# Altium project Marsault1.PrjPcb (part 4 of 7)

## Sheet MICROCONTROLLER.SchDoc
size A4; SheetNumber: 4; SheetTotal: 9
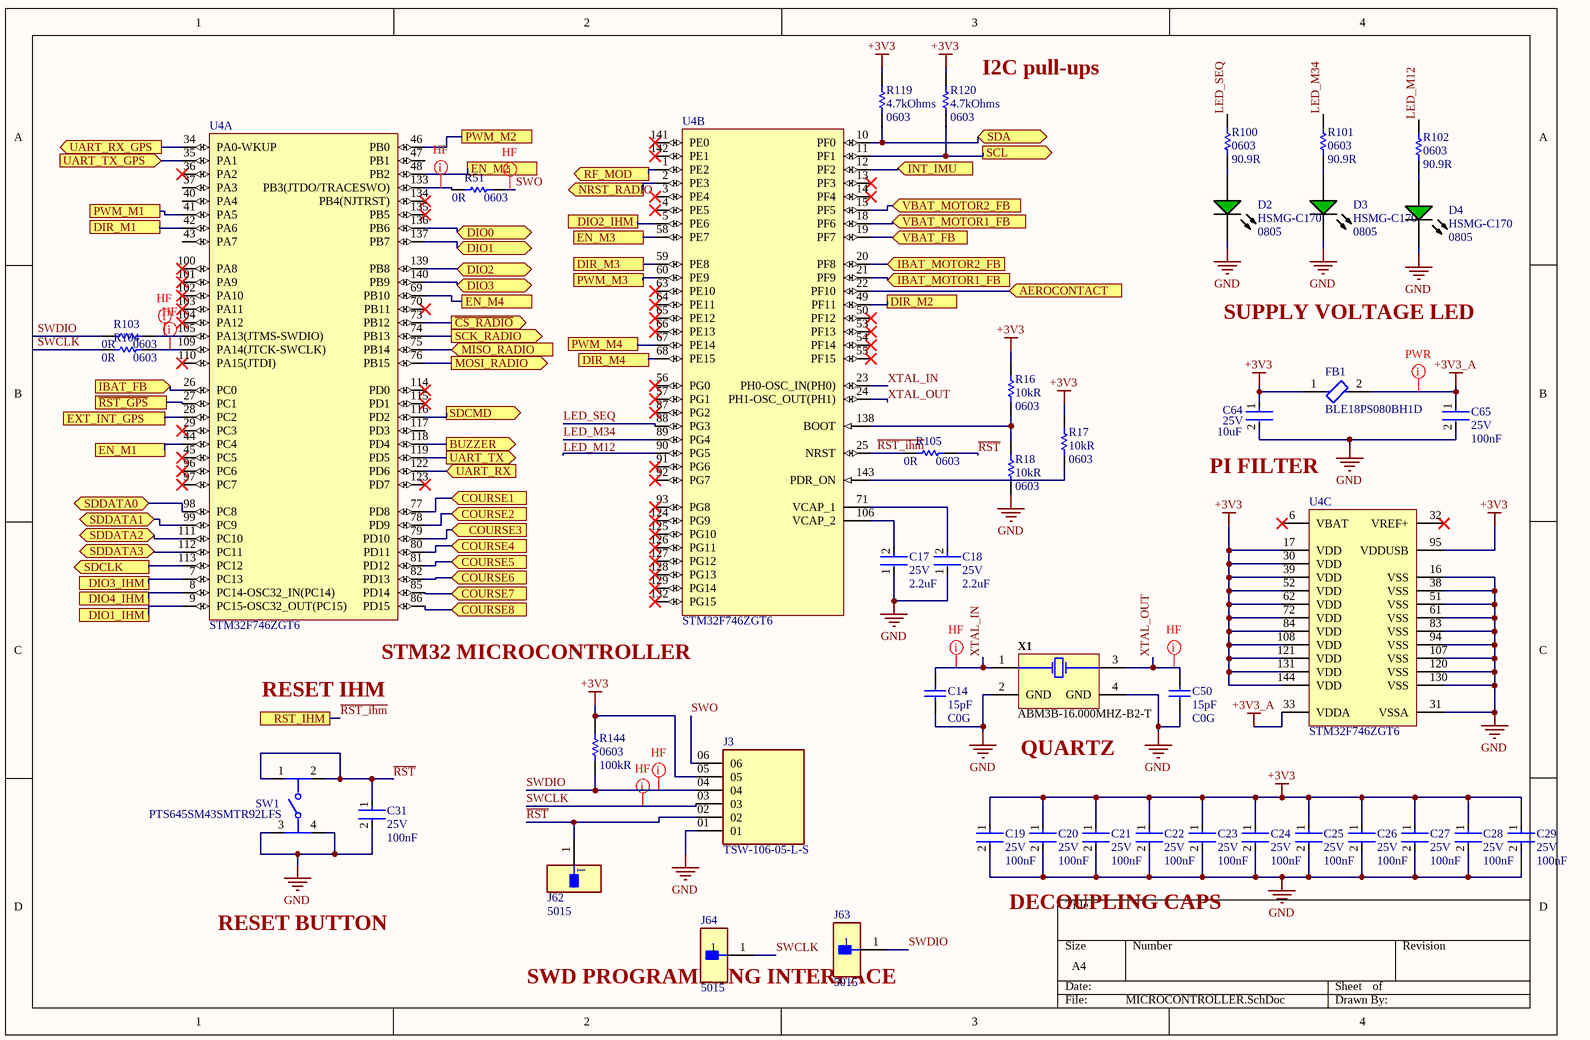
[diagram p4: MICROCONTROLLER.SchDoc]

### Parts
C14  Capacitance: 15pF  Dielectric: C0G  [CAPC1608X92X38ML15T08]  (hidden comment: VJ0603D150JXPAJ)
C17  Voltage Rating (DC): 25V  Capacitance: 2.2uF  [FP-C1608-080-0_1-MFG]  (hidden comment: C1608X5R1E225K080AB)
C18  Voltage Rating (DC): 25V  Capacitance: 2.2uF  [FP-C1608-080-0_1-MFG]  (hidden comment: C1608X5R1E225K080AB)
C19  Voltage Rating (DC): 25V  Capacitance: 100nF  [FP-CGA3E-0_3-0_1-MFG]  (hidden comment: CGA3E2X7R1E104K080AA)
C20  Voltage Rating (DC): 25V  Capacitance: 100nF  [FP-CGA3E-0_3-0_1-MFG]  (hidden comment: CGA3E2X7R1E104K080AA)
C21  Voltage Rating (DC): 25V  Capacitance: 100nF  [FP-CGA3E-0_3-0_1-MFG]  (hidden comment: CGA3E2X7R1E104K080AA)
C22  Voltage Rating (DC): 25V  Capacitance: 100nF  [FP-CGA3E-0_3-0_1-MFG]  (hidden comment: CGA3E2X7R1E104K080AA)
C23  Voltage Rating (DC): 25V  Capacitance: 100nF  [FP-CGA3E-0_3-0_1-MFG]  (hidden comment: CGA3E2X7R1E104K080AA)
C24  Voltage Rating (DC): 25V  Capacitance: 100nF  [FP-CGA3E-0_3-0_1-MFG]  (hidden comment: CGA3E2X7R1E104K080AA)
C25  Voltage Rating (DC): 25V  Capacitance: 100nF  [FP-CGA3E-0_3-0_1-MFG]  (hidden comment: CGA3E2X7R1E104K080AA)
C26  Voltage Rating (DC): 25V  Capacitance: 100nF  [FP-CGA3E-0_3-0_1-MFG]  (hidden comment: CGA3E2X7R1E104K080AA)
C27  Voltage Rating (DC): 25V  Capacitance: 100nF  [FP-CGA3E-0_3-0_1-MFG]  (hidden comment: CGA3E2X7R1E104K080AA)
C28  Voltage Rating (DC): 25V  Capacitance: 100nF  [FP-CGA3E-0_3-0_1-MFG]  (hidden comment: CGA3E2X7R1E104K080AA)
C29  Voltage Rating (DC): 25V  Capacitance: 100nF  [FP-CGA3E-0_3-0_1-MFG]  (hidden comment: CGA3E2X7R1E104K080AA)
C31  Voltage Rating (DC): 25V  Capacitance: 100nF  [FP-CGA3E-0_3-0_1-MFG]  (hidden comment: CGA3E2X7R1E104K080AA)
C50  Capacitance: 15pF  Dielectric: C0G  [CAPC1608X92X38ML15T08]  (hidden comment: VJ0603D150JXPAJ)
C64  Voltage Rating (DC): 25V  Capacitance: 10uF  [FP-C2012-125-0_2-IPC_B]  (hidden comment: C2012X5R1E106K125AB)
C65  Voltage Rating (DC): 25V  Capacitance: 100nF  [FP-CGA3E-0_3-0_1-MFG]  (hidden comment: CGA3E2X7R1E104K080AA)
D2  HSMG-C170  Case/Package: 0805  [AVAG-HSMX-C170_V]
D3  HSMG-C170  Case/Package: 0805  [AVAG-HSMX-C170_V]
D4  HSMG-C170  Case/Package: 0805  [AVAG-HSMX-C170_V]
FB1  BLE18PS080BH1D  [FP-BLE18-0_15-t0_6-MFG]
J3  TSW-106-05-L-S  [SAMTEC_TSW-106-05-L-S]
J62  5015  [FP-5015-MFG]
J63  5015  [FP-5015-MFG]
J64  5015  [FP-5015-MFG]
R16  Resistance: 10kR  Case Code (Imperial): 0603  [RESC1609X55X30LL15T15]  (hidden comment: ERJ3EKF1002V)
R17  Resistance: 10kR  Case Code (Imperial): 0603  [RESC1609X55X30LL15T15]  (hidden comment: ERJ3EKF1002V)
R18  Resistance: 10kR  Case Code (Imperial): 0603  [RESC1609X55X30LL15T15]  (hidden comment: ERJ3EKF1002V)
R51  Case Code (Imperial): 0603  Resistance: 0R  [RESC1608X55X25ML10T15]  (hidden comment: RC0603JR-070RL)
R100  Case Code (Imperial): 0603  Resistance: 90.9R  [RESC1609X50X30NL10T20]  (hidden comment: CRCW060390R9FKEA)
R101  Case Code (Imperial): 0603  Resistance: 90.9R  [RESC1609X50X30NL10T20]  (hidden comment: CRCW060390R9FKEA)
R102  Case Code (Imperial): 0603  Resistance: 90.9R  [RESC1609X50X30NL10T20]  (hidden comment: CRCW060390R9FKEA)
R103  Case Code (Imperial): 0603  Resistance: 0R  [RESC1608X55X25ML10T15]  (hidden comment: RC0603JR-070RL)
R104  Case Code (Imperial): 0603  Resistance: 0R  [RESC1608X55X25ML10T15]  (hidden comment: RC0603JR-070RL)
R105  Case Code (Imperial): 0603  Resistance: 0R  [RESC1608X55X25ML10T15]  (hidden comment: RC0603JR-070RL)
R119  Resistance: 4.7kOhms  Case Code - in: 0603  [RESC1608X55X25LL10T15]  (hidden comment: RC0603FR-074K7L)
R120  Resistance: 4.7kOhms  Case Code - in: 0603  [RESC1608X55X25LL10T15]  (hidden comment: RC0603FR-074K7L)
R144  Case Code (Imperial): 0603  Resistance: 100kR  [RESC1608X55X30ML20T20]  (hidden comment: ERA3AEB104V)
SW1  PTS645SM43SMTR92LFS  [FP-PTS645SM43SMTR92LFS-MFG]
U4  STM32F746ZGT6  [STM-LQFP144_V]  (parts A,B,C of 3)
X1  ABM3B-16.000MHZ-B2-T  [ABRA-ABM3B-4_V]

### Ports
AEROCONTACT (in), BUZZER (out), COURSE1 (in), COURSE2 (in), COURSE3 (in), COURSE4 (in), COURSE5 (in), COURSE6 (in), COURSE7 (in), COURSE8 (in), DIO0 (bidir), DIO1 (bidir), DIO1_IHM, DIO2 (bidir), DIO2_IHM, DIO3 (bidir), DIO3_IHM, DIO4_IHM, DIR_M1, DIR_M2, DIR_M3, DIR_M4, EN_M1, EN_M2, EN_M3, EN_M4, EXT_INT_GPS, IBAT_FB (in), IBAT_MOTOR1_FB (in), IBAT_MOTOR2_FB (in), INT_IMU (in), MISO_RADIO (in), MOSI_RADIO (out), NRST_RADIO (out), PWM_M1, PWM_M2, PWM_M3, PWM_M4, RF_MOD (out), RST_IHM, SCK_RADIO (out), SCL (out), SDA (bidir), SDCLK (out), SDCMD (out), SDDATA0 (bidir), SDDATA1 (bidir), SDDATA2 (bidir), SDDATA3 (bidir), UART_RX (in), UART_RX_GPS (out), UART_TX (out), UART_TX_GPS (in), VBAT_FB (in), VBAT_MOTOR1_FB (in), VBAT_MOTOR2_FB (in), ~{CS_RADIO} (out), ~{RST_GPS}

### Nets
+3V3: C19.1 C20.1 C21.1 C22.1 C23.1 C24.1 C25.1 C26.1 C27.1 C28.1 C29.1 C64.1 FB1.1 J3.05 R16.2 R17.2 R119.2 R120.2 R144.2 U4.17(VDD) U4.30(VDD) U4.39(VDD) U4.52(VDD) U4.62(VDD) U4.72(VDD) U4.84(VDD) U4.95(VDDUSB) U4.108(VDD) U4.121(VDD) U4.131(VDD) U4.144(VDD)
+3V3_A: C65.1 FB1.2 U4.33(VDDA)
GND: C14.1 C17.1 C18.1 C19.2 C20.2 C21.2 C22.2 C23.2 C24.2 C25.2 C26.2 C27.2 C28.2 C29.2 C31.2 C50.1 C64.2 C65.2 D2.2(K) D3.2(K) D4.2(K) J3.01 R18.1 SW1.3 SW1.4 U4.16(VSS) U4.31(VSSA) U4.38(VSS) U4.51(VSS) U4.61(VSS) U4.83(VSS) U4.94(VSS) U4.107(VSS) U4.120(VSS) U4.130(VSS) X1.2(GND) X1.4(GND)
~{RST}: C31.1 J3.02 J62.1 R105.2 SW1.1 SW1.2
~{RST_GPS}: U4.27(PC1) ; port ~{RST_GPS}
~{RST_ihm}: R105.1 U4.25(NRST) ; port RST_IHM
DIO1_IHM: U4.9(PC15-OSC32_OUT(PC15)) ; port DIO1_IHM
DIO2_IHM: U4.5(PE6) ; port DIO2_IHM
DIO3_IHM: U4.7(PC13) ; port DIO3_IHM
DIO4_IHM: U4.8(PC14-OSC32_IN(PC14)) ; port DIO4_IHM
LED_M12: R102.2 U4.90(PG5)
LED_M34: R101.2 U4.89(PG4)
LED_SEQ: R100.2 U4.88(PG3)
MISO_RADIO: U4.75(PB14) ; port MISO_RADIO
SDCLK: U4.113(PC12) ; port SDCLK
SDCMD: U4.116(PD2) ; port SDCMD
SDDATA0: U4.98(PC8) ; port SDDATA0
SDDATA1: U4.99(PC9) ; port SDDATA1
SDDATA2: U4.111(PC10) ; port SDDATA2
SDDATA3: U4.112(PC11) ; port SDDATA3
SWCLK: J3.03 J64.1 R104.1
SWDIO: J3.04 J63.1 R103.1 R144.1
SWO: J3.06 R51.2
XTAL_IN: C14.2 U4.23(PH0-OSC_IN(PH0)) X1.1(X1)
XTAL_OUT: C50.2 U4.24(PH1-OSC_OUT(PH1)) X1.3(X2)
NetC17_2: C17.2 U4.106(VCAP_2)
NetC18_2: C18.2 U4.71(VCAP_1)
NetD2_1: D2.1(A) R100.1
NetD3_1: D3.1(A) R101.1
NetD4_1: D4.1(A) R102.1
NetJ71_1: U4.34(PA0-WKUP) ; port UART_RX_GPS
NetJ73_1: U4.35(PA1) ; port UART_TX_GPS
NetR16_1: R16.1 R18.2 U4.138(BOOT)
NetR17_1: R17.1 U4.143(PDR_ON)
NetR22_1: U4.28(PC2) ; port EXT_INT_GPS
NetR26_1: R120.1 U4.11(PF1) ; port SCL
NetR28_1: R119.1 U4.10(PF0) ; port SDA
NetR34_1: U4.73(PB12) ; port ~{CS_RADIO}
NetR35_1: U4.2(PE3) ; port NRST_RADIO
NetR36_1: U4.1(PE2) ; port RF_MOD
NetR39_1: U4.140(PB9) ; port DIO3
NetR40_1: U4.139(PB8) ; port DIO2
NetR43_1: U4.137(PB7) ; port DIO1
NetR44_1: U4.136(PB6) ; port DIO0
NetR45_1: U4.12(PF2) ; port INT_IMU
NetR46_1: U4.22(PF10) ; port AEROCONTACT
NetR51_1: R51.1 U4.133(PB3(JTDO/TRACESWO))
NetR54_1: U4.76(PB15) ; port MOSI_RADIO
NetR55_1: U4.74(PB13) ; port SCK_RADIO
NetR56_2: U4.41(PA5) ; port PWM_M1
NetR57_2: U4.42(PA6) ; port DIR_M1
NetR58_2: U4.44(PC4) ; port EN_M1
NetR59_1: U4.118(PD4) ; port BUZZER
NetR61_2: U4.46(PB0) ; port PWM_M2
NetR62_2: U4.49(PF11) ; port DIR_M2
NetR63_2: U4.48(PB2) ; port EN_M2
NetR69_2: U4.60(PE9) ; port PWM_M3
NetR70_2: U4.59(PE8) ; port DIR_M3
NetR71_1: U4.26(PC0) ; port IBAT_FB
NetR72_2: U4.58(PE7) ; port EN_M3
NetR73_1: U4.19(PF7) ; port VBAT_FB
NetR74_1: U4.21(PF9) ; port IBAT_MOTOR1_FB
NetR76_1: U4.18(PF6) ; port VBAT_MOTOR1_FB
NetR77_1: U4.20(PF8) ; port IBAT_MOTOR2_FB
NetR78_1: U4.15(PF5) ; port VBAT_MOTOR2_FB
NetR79_2: U4.67(PE14) ; port PWM_M4
NetR80_2: U4.68(PE15) ; port DIR_M4
NetR81_2: U4.69(PB10) ; port EN_M4
NetR83_2: U4.77(PD8) ; port COURSE1
NetR84_2: U4.78(PD9) ; port COURSE2
NetR85_2: U4.79(PD10) ; port COURSE3
NetR103_2: R103.2 U4.105(PA13(JTMS-SWDIO))
NetR104_2: R104.2 U4.109(PA14(JTCK-SWCLK))
NetR118_2: U4.80(PD11) ; port COURSE4
NetR124_2: U4.81(PD12) ; port COURSE5
NetR125_2: U4.82(PD13) ; port COURSE6
NetR126_2: U4.85(PD14) ; port COURSE7
NetR127_2: U4.86(PD15) ; port COURSE8
NetR128_2: U4.122(PD6) ; port UART_RX
NetR129_2: U4.119(PD5) ; port UART_TX

Not connected (* = marked no-connect by the designer): U4 3(PE4)* 4(PE5)* 6(VBAT)* 13(PF3)* 14(PF4)* 29(PC3)* 32(VREF+)* 36(PA2)* 37(PA3) 40(PA4) 43(PA7) 45(PC5)* 47(PB1) 50(PF12)* 53(PF13)* 54(PF14)* 55(PF15)* 56(PG0)* 57(PG1)* 63(PE10)* 64(PE11)* 65(PE12)* 66(PE13)* 70(PB11)* 87(PG2)* 91(PG6)* 92(PG7)* 93(PG8)* 96(PC6)* 97(PC7)* 100(PA8)* 101(PA9)* 102(PA10)* 103(PA11)* 104(PA12)* 110(PA15(JTDI))* 114(PD0)* 115(PD1)* 117(PD3) 123(PD7)* 124(PG9)* 125(PG10)* 126(PG11)* 127(PG12)* 128(PG13)* 129(PG14)* 132(PG15)* 134(PB4(NJTRST))* 135(PB5)* 141(PE0)* 142(PE1)*

### Layout directives
net class HF: NetR51_1, NetR103_2, NetR104_2, SWCLK, SWDIO, SWO, XTAL_IN, XTAL_OUT
net class PWR: +3V3_A

### Notes on the sheet
- (near R120) I2C pull-ups
- SUPPLY VOLTAGE LED
- PI FILTER
- (near U4) STM32 MICROCONTROLLER
- RESET IHM
- (near X1) QUARTZ
- RESET BUTTON
- DECOUPLING CAPS
- (near J64) SWD PROGRAMMING INTERFACE

### Library data of the parts
C14 C50 = CMP-2006-01493-1: Manufacturer: Vitramon; Voltage Rating: 250V; Tolerance: 5%; Temperature Coefficient: 30ppm/°C; Part Number: VJ0603D150JXPAJ; Supplier 1: Mouser; Supplier Part Number 1: 77-VJ0603D150JXPAJ; Manufacturer Part Number: VJ0603D150JXPAJ; RoHS: Yes; Category: Ceramic Capacitors; Stock 1: 8975; Pricing 1: 1=0,36000, 10=0,25100, 50=0,25100, 100=0,15100, 1000=0,09500, 10000=0,09500 (USD); Mount: Surface Mount,PCB; Case/Package: 0603; Case Code (Imperial): 0603; Case Code (Metric): 1608; Min Operating Temperature: -55°C; Max Operating Temperature: 125°C; Packaging: Tape and Reel; Package Quantity: 1; Voltage Rating (DC): 250V; Voltage: 250V; Termination: SMD/SMT; Series: VJ HIFREQ; Construction: Flat; Length: 1.6mm; Width: 0.8mm; Height: 0.92mm; Thickness: 0.037inch; Depth: 0.8mm; Radiation Hardening: No; Lead Free: Lead Free; RoHS Compliant: Yes; REACH SVHC: Unknown; ComponentLink1URL: https://datasheet.ciiva.com/30503/0900766b812428e7-30503866.pdf?src-supplier=RSComponents; ComponentLink1Description: https://datasheet.ciiva.com/30503/0900766b812428e7-30503866.pdf?src-supplier=RSComponents; ComponentLink2URL: https://datasheet.ciiva.com/11484/vjhifreq-11484678.pdf?src-supplier=Avnet; ComponentLink2Description: https://datasheet.ciiva.com/11484/vjhifreq-11484678.pdf?src-supplier=Avnet; ComponentLink3URL: https://datasheet.ciiva.com/16511/vj0402dseries-16511368.pdf?src-supplier=Future+Electronics; ComponentLink3Description: https://datasheet.ciiva.com/16511/vj0402dseries-16511368.pdf?src-supplier=Future+Electronics; ComponentLink4URL: https://datasheet.ciiva.com/6252/vjhifreq-6252938.pdf?src-supplier=Digi-Key; ComponentLink4Description: https://datasheet.ciiva.com/6252/vjhifreq-6252938.pdf?src-supplier=Digi-Key; ComponentLink5URL: https://datasheet.ciiva.com/6252/vjhifreq-6252941.pdf?src-supplier=Digi-Key; ComponentLink5Description: https://datasheet.ciiva.com/6252/vjhifreq-6252941.pdf?src-supplier=Digi-Key
C17 C18 = CMP-08246-003049-1: Multilayer Ceramic Capacitors 2.2μF ±10% 25V X5R SMD 0603; Manufacturer: TDK; Termination: SMD/SMT; Dielectric Material: Ceramic; REACH SVHC: No SVHC; Voltage Rating: 25V; RoHS Compliant: Yes; Case Code (Imperial): 0603; Case/Package: 0603; Height: 0.8mm; Mount: Surface Mount; Min Operating Temperature: -55°C; Tolerance: 10%; Radiation Hardening: No; Dielectric: X5R; Depth: 0.8mm; Package Quantity: 4000; Length: 1.6mm; Weight: 7.1E-05oz; Resistor Type: Ceramic; Series: C; Thickness: 0.035inch; Width: 0.031inch; Case Code (Metric): 1608; Lead Free: Lead Free; Max Operating Temperature: 85°C; Packaging: Tape and Reel; Supplier 1: Mouser; Supplier Part Number 1: 810-C1608X5R1E225K; Manufacturer Part Number: C1608X5R1E225K080AB; RoHS: Yes; Category: Ceramic Capacitors; Stock 1: 34439; Pricing 1: 1=0,23000, 10=0,13500, 50=0,13500, 100=0,06900, 1000=0,04700, 10000=0,03800 (USD); ComponentLink1URL: https://datasheet.ciiva.com/26834/getdatasheetpartid-750446-26834363.pdf?src-supplier=Verical; ComponentLink1Description: https://datasheet.ciiva.com/26834/getdatasheetpartid-750446-26834363.pdf?src-supplier=Verical; ComponentLink2URL: https://datasheet.ciiva.com/28693/mlcc-commercial-general-en-28693433.pdf?src-supplier=Element14; ComponentLink2Description: https://datasheet.ciiva.com/28693/mlcc-commercial-general-en-28693433.pdf?src-supplier=Element14; ComponentLink3URL: https://datasheet.ciiva.com/6290/tdkmlcccaprange-6290830.pdf?src-supplier=Digi-Key; ComponentLink3Description: https://datasheet.ciiva.com/6290/tdkmlcccaprange-6290830.pdf?src-supplier=Digi-Key; ComponentLink4URL: https://datasheet.ciiva.com/28451/1796654-28451166.pdf?src-supplier=Element14; ComponentLink4Description: https://datasheet.ciiva.com/28451/1796654-28451166.pdf?src-supplier=Element14; ComponentLink5URL: https://datasheet.ciiva.com/24220/mlcc-commercial-general-en-24220495.pdf?src-supplier=Mouser; ComponentLink5Description: https://datasheet.ciiva.com/24220/mlcc-commercial-general-en-24220495.pdf?src-supplier=Mouser
C19-C29 C31 C65 = CMP-08246-002186-1: Cap Ceramic 100nF 25V X7R 10% Pad SMD 0603 +125°C Automotive T/R; Manufacturer: TDK; Composition: Ceramic; Dielectric: X7R; Ratings: AEC-Q200; Length: 1.6mm; REACH SVHC: No SVHC; Width: 0.031inch; Packaging: Tape and Reel; Case/Package: 0603; Height: 0.8mm; Termination: SMD/SMT; Max Operating Temperature: 125°C; Thickness: 0.035inch; Case Code (Metric): 1608; Lead Free: Lead Free; Mount: Surface Mount; Voltage Rating: 25V; Tolerance: 10%; Weight: 7.1E-05oz; Min Operating Temperature: -55°C; Package Quantity: 1; Depth: 0.8mm; Case Code (Imperial): 0603; Supplier 1: Mouser; Supplier Part Number 1: 810-CGA3E2X7R1E104K; Manufacturer Part Number: CGA3E2X7R1E104K080AA; RoHS: Yes; Category: Ceramic Capacitors; Stock 1: 488891; Pricing 1: 1=0,12000, 10=0,05600, 50=0,05600, 100=0,02500, 1000=0,01400, 10000=0,01000 (USD); Series: CGA; Resistor Type: Ceramic; RoHS Compliant: Yes; ComponentLink1URL: https://datasheet.ciiva.com/24220/cga3e2x7r1e104k080aa-265934-24220022.pdf?src-supplier=Mouser; ComponentLink1Description: https://datasheet.ciiva.com/24220/cga3e2x7r1e104k080aa-265934-24220022.pdf?src-supplier=Mouser; ComponentLink2URL: https://datasheet.ciiva.com/22725/1735392-22725638.pdf?src-supplier=Element14; ComponentLink2Description: https://datasheet.ciiva.com/22725/1735392-22725638.pdf?src-supplier=Element14; ComponentLink3URL: https://datasheet.ciiva.com/22725/1735392-22725639.pdf?src-supplier=Element14; ComponentLink3Description: https://datasheet.ciiva.com/22725/1735392-22725639.pdf?src-supplier=Element14; ComponentLink4URL: https://datasheet.ciiva.com/16427/mlccspec-automotive-general-midvoltage-en-16427320.pdf?src-supplier=Future+Electronics; ComponentLink4Description: https://datasheet.ciiva.com/16427/mlccspec-automotive-general-midvoltage-en-16427320.pdf?src-supplier=Future+Electronics; ComponentLink5URL: https://datasheet.ciiva.com/23803/1735392-23803082.pdf?src-supplier=Newark; ComponentLink5Description: https://datasheet.ciiva.com/23803/1735392-23803082.pdf?src-supplier=Newark
C64 = CMP-08246-002675-1: Multilayer Ceramic Capacitors 10μF ±10% 25V X5R SMD 0805; Manufacturer: TDK; Packaging: Tape and Reel; Dielectric: X5R; Case/Package: 0805; Lead Free: Lead Free; Dielectric Material: Ceramic; Series: C; Termination: SMD/SMT; Voltage: 25V; Depth: 1.25mm; Max Operating Temperature: 85°C; Resistor Type: Ceramic; Weight: 0.000194oz; Case Code (Metric): 2012; Height: 1.25mm; Mount: Surface Mount; Voltage Rating: 25V; Length: 2mm; REACH SVHC: No SVHC; Min Operating Temperature: -55°C; Case Code (Imperial): 0805; Thickness: 0.057inch; Width: 0.049inch; Tolerance: 10%; Package Quantity: 1; Supplier 1: Mouser; Supplier Part Number 1: 810-C2012X5R1E106K; Manufacturer Part Number: C2012X5R1E106K125AB; RoHS: Yes; Category: Ceramic Capacitors; Stock 1: 75897; Pricing 1: 1=0,34000, 10=0,24100, 50=0,24100, 100=0,14400, 1000=0,09100, 10000=0,08800 (USD); ComponentLink1URL: https://datasheet.ciiva.com/22725/1913358-22725561.pdf?src-supplier=Element14; ComponentLink1Description: https://datasheet.ciiva.com/22725/1913358-22725561.pdf?src-supplier=Element14; ComponentLink2URL: https://datasheet.ciiva.com/16394/general-b11-16394044.pdf?src-supplier=Future+Electronics; ComponentLink2Description: https://datasheet.ciiva.com/16394/general-b11-16394044.pdf?src-supplier=Future+Electronics; ComponentLink3URL: https://datasheet.ciiva.com/24216/mlcc-commercial-general-en-24216237.pdf?src-supplier=Mouser; ComponentLink3Description: https://datasheet.ciiva.com/24216/mlcc-commercial-general-en-24216237.pdf?src-supplier=Mouser
D2-D4 = CMP-2000-05062-1: Chip LED, Green, 2.2 V, -40 to 85 degC, 2-Pin SMD, Pb-Free, Tape and Reel; Manufacturer: Avago; No. of Pins: 2; Peak Wavelength: 570nm; SVHC: NoSVHC(16-Jun-2014); Dominant Wavelength: 572nm; Forward Current If: 20mA; Viewing Angle: 170deg; Lens Shape: Rectangular; PIV Max: 5V; External Width: 1.25mm; LED Type: Standard; External Depth: 0.8mm; Opto Mounting Orientation: Top; Luminous Intensity: 15mcd; Luminous Intensity Min: 4mcd; Forward Voltage VF Max: 2.6V; External Length / Height: 2mm; Bulb Size: 1.25mmx1.4mm; Light Area Height: 1mm; Voltage Vf Typ: 2.2V; Color: Green,Yellow; Lens Color: White; Lens Style: Diffused,Colorless,Rectangular; Lens Transparency: Diffused; Power Dissipation: 52mW; Number of Elements: 1; Operating Temperature Max: 85degC; Datasheet Version: Oct-08; MSL: MSL2A-4weeks; Peak Forward Current: 20mA; Package Description: 2-Pin Surface Mount Device, Body 2 x 1.25 mm, Height 0.8 mm; Datasheet URL: https://datasheet.ciiva.com/29280/180495-da-01-en-chip-led-hsmg-c170-gelb-gruen-29280971.pdf; Storage Temperature Min: -40degC; LED Colour: Green; Wavelength Typ: 570nm; Mounting Type: SMD; Forward Current If Max: 20mA; Dominant Wavelength Typ: 572nm; LED Mounting: SMD; Operating Temperature Range: -30degCto+85degC; Operating Temperature Min: -30degC; Manufacturer URL: http://www.avagotech.com/; Packaging: CutTape; Luminous Intensity Typ: 15mcd; Package Reference: HSMX-C170; Storage Temperature Max: 85degC; Opto Case Style: SMD; Forward Voltage: 2.2V; Supplier 1: Mouser; Supplier Part Number 1: 630-HSMG-C170; Manufacturer Part Number: HSMG-C170; RoHS: Yes; Category: LEDs; Stock 1: 2037; Pricing 1: 1=0,39000, 10=0,25800, 50=0,25800, 100=0,12000, 1000=0,10000, 4000=0,08400, 8000=0,07600, 10000=0,07600, 24000=0,07100, 48000=0,06700 (USD); Mount: Surface Mount; Number of Pins: 2; Case Code (Metric): 2012; Case Code (Imperial): 0805; Min Operating Temperature: -30°C; Max Operating Temperature: 85°C; Wavelength: 572nm; Forward Current: 20mA; Test Current: 20mA; Package Quantity: 4000; Illumination Color: Green; Power Rating: 52mW; Number of LEDs: 1; Reverse Voltage: 5V; Series: -; Length: 2mm; Width: 1.25mm; Height: 0.8mm; Depth: 1.25mm; Radiation Hardening: No; REACH SVHC: No SVHC; Lead Free: Lead Free; RoHS Compliant: Yes
FB1 = CMP-06046-000147-1: Ferrite Chip Bead 8.5Ω ±25% 5A, DCR 0.004Ω 0603 AEC-200; Manufacturer: Murata; Supplier 1: Mouser; Supplier Part Number 1: 81-BLE18PS080BH1D; Manufacturer Part Number: BLE18PS080BH1D; RoHS: Yes; Category: Ferrite Beads and Chips; Stock 1: 450; Pricing 1: 1=0,28000, 10=0,19000, 50=0,19000, 100=0,16000, 1000=0,11200, 10000=0,09100 (USD)
J3 = TSW-106-05-L-S: MF: {'manufacturer': u'Samtec'}; MP: TSW-106-05-L-S; Price: None; Package: None; Value: *; Availability: Unavailable
J62-J64 = CMP-2000-05183-2: PC TEST POINT MINIATURE; Manufacturer: keystone; Number Of Contacts: 1; Conn Orientation: Straight; Category: Conn; Manufacturer Part Number: 5015; Digikey Description: PC TEST POINT MINIATURE; Automotive: No; Lead Free: Yes; Octopart: https://octopart.com/5015-keystone-3822; ComponentLink2URL: http://www.keyelco.com/product-pdf.cfm?p=1353; Package: 5015; RoHS: TRUE; Device Class L3: unset; Device Class L2: unset; Contact Material: Silver; Device Class L1: Connectors; Height: 1.65mm; ComponentLink2Description: Datasheet; Supplier 1: Mouser; Supplier Part Number 1: 534-5015; Stock 1: 1597055; Pricing 1: 1=0,45000, 10=0,43800, 25=0,36500, 50=0,36500, 100=0,30200, 250=0,27200, 500=0,25800, 1000=0,21300, 2000=0,19600, 5000=0,17200, 10000=0,17200 (USD); Mount: Surface Mount; Contact Plating: Silver,Tin,Lead; Material: Bronze,Silver; Color: White; Package Quantity: 1; Packaging: Tape and Reel; Series: -; Termination: Solder; Number of Ports: 1; Orientation: Straight; Length: 2.66mm; Depth: 1.01mm; Thickness: 0.01inch; REACH SVHC: No SVHC; RoHS Compliant: Yes; ComponentLink1URL: https://datasheet.ciiva.com/1123/5015-1123862.pdf?src-supplier=Newark; ComponentLink1Description: https://datasheet.ciiva.com/1123/5015-1123862.pdf?src-supplier=Newark; ComponentLink3URL: https://datasheet.ciiva.com/2917/5015-2917616.pdf?src-supplier=Digi-Key; ComponentLink3Description: https://datasheet.ciiva.com/2917/5015-2917616.pdf?src-supplier=Digi-Key; ComponentLink4URL: https://datasheet.ciiva.com/2917/5015-2917617.pdf?src-supplier=Digi-Key; ComponentLink4Description: https://datasheet.ciiva.com/2917/5015-2917617.pdf?src-supplier=Digi-Key; ComponentLink5URL: https://datasheet.ciiva.com/16883/70182998-16883734.pdf?src-supplier=Allied+Electronics; ComponentLink5Description: https://datasheet.ciiva.com/16883/70182998-16883734.pdf?src-supplier=Allied+Electronics
R16-R18 = CMP-1012-00623-3: Chip Resistor, 10 KOhm, +/- 1%, 0.1 W, -55 to 155 degC, 0603 (1608 Metric), RoHS, Tape and Reel; Manufacturer: Panasonic; Manufacturer Part Number: ERJ-3EKF1002V; Voltage Rating: 75V; Power Rating: 100mW; Temperature Coefficient: 100ppm\/degreesC; Case\/Package: 0603; Number of Pins: 2; Package Reference: 603; Depth: 0.8mm; Mount: SurfaceMount; Package Description: 2-Pin Surface Mount Device, Body 1.6 x 0.85 mm; Datasheet Version: 02/2017; Length: 1.6mm; Lead Free: LeadFree; Height: 0.45mm; Number of Terminations: 2; Max Power Dissipation: 100mW; Min Operating Temperature: -55degC; Datasheet URL: https://industrial.panasonic.com/cdbs/www-data/pdf/RDA0000/AOA0000C304.pdf; Termination: SMD/SMT; Case Code (Metric): 1608; Tolerance: 1%; Max Operating Temperature: 155degC; RoHSCompliant: true; Voltage Rating (DC): 75V; Radiation Hardening: No; Packaging: TapeandReel; Composition: ThickFilm; Mounting Technology: SurfaceMount; Manufacturer URL: http://www.panasonic.com/; Width: 0.031inch; REACH SVHC: NoSVHC; Contact Plating: Tin; Military Standard: Not; Package Quantity: 1; Supplier 1: Mouser; Supplier Part Number 1: 667-ERJ-3EKF1002V; RoHS: Yes; Category: Chip SMD Resistors; Stock 1: 20455; Pricing 1: 1=0,10000, 10=0,04000, 50=0,04000, 100=0,01700, 1000=0,00700, 5000=0,00500, 10000=0,00500 (USD); Case/Package: 0603; Size Code: 0603; Resistor Type: Thick Film; Series: ERJ; Resistance Tolerance: 1%; Construction: Rectangular; Features: Automotive AEC-Q200; Technology: THICK FILM; RoHS Compliant: Yes; ComponentLink1URL: https://datasheet.ciiva.com/16511/aoa0000ce2-16511861.pdf?src-supplier=Avnet+Asia; ComponentLink1Description: https://datasheet.ciiva.com/16511/aoa0000ce2-16511861.pdf?src-supplier=Avnet+Asia; ComponentLink2URL: https://datasheet.ciiva.com/46372/1678782-46372725.pdf?src-supplier=Element14; ComponentLink2Description: https://datasheet.ciiva.com/46372/1678782-46372725.pdf?src-supplier=Element14; ComponentLink3URL: https://datasheet.ciiva.com/28514/426256-28514198.pdf?src-supplier=Element14; ComponentLink3Description: https://datasheet.ciiva.com/28514/426256-28514198.pdf?src-supplier=Element14; ComponentLink4URL: https://datasheet.ciiva.com/9194/aoa0000ce2-9194199.pdf?src-supplier=Avnet; ComponentLink4Description: https://datasheet.ciiva.com/9194/aoa0000ce2-9194199.pdf?src-supplier=Avnet; ComponentLink5URL: https://datasheet.ciiva.com/7830/aoa0000ce2-7830729.pdf?src-supplier=Element14; ComponentLink5Description: https://datasheet.ciiva.com/7830/aoa0000ce2-7830729.pdf?src-supplier=Element14; ComponentLink6URL: https://datasheet.ciiva.com/17212/aoa0000ce2-17212105.pdf?src-supplier=Avnet+Europe; ComponentLink6Description: https://datasheet.ciiva.com/17212/aoa0000ce2-17212105.pdf?src-supplier=Avnet+Europe; ComponentLink7URL: https://datasheet.ciiva.com/30208/aoa0000ce2-30208985.pdf?src-supplier=Onlinecomponents.com; ComponentLink7Description: https://datasheet.ciiva.com/30208/aoa0000ce2-30208985.pdf?src-supplier=Onlinecomponents.com; ComponentLink8URL: https://datasheet.ciiva.com/48530/aoa0000ce2-48530988.pdf?src-supplier=Avnet; ComponentLink8Description: https://datasheet.ciiva.com/48530/aoa0000ce2-48530988.pdf?src-supplier=Avnet; ComponentLink9URL: https://datasheet.ciiva.com/24070/aoa0000ce2-24070318.pdf?src-supplier=Mouser; ComponentLink9Description: https://datasheet.ciiva.com/24070/aoa0000ce2-24070318.pdf?src-supplier=Mouser; ComponentLink10URL: https://datasheet.ciiva.com/16759/70260748-16759807.pdf?src-supplier=Allied+Electronics; ComponentLink10Description: https://datasheet.ciiva.com/16759/70260748-16759807.pdf?src-supplier=Allied+Electronics
R51 R103-R105 = CMP-2100-03667-1: Chip Resistor, 0 Ohm, +/- 5%, 0.1 W, -55 to 155 degC, 0603 (1608 Metric), RoHS, Tape and Reel; Manufacturer: Yageo; Temperature Coefficient: 200ppm/degreesC; Voltage Rating: 50V; Power Rating: 100mW; Width: 0.8mm; Max Operating Temperature: 155degC; Tolerance: 5%; Package Reference: 0603; Height: 0.45mm; Depth: 0.8mm; Package Description: 2-Pin Surface Mount Device, Body 1.6 x 0.8 mm; Termination: SMD/SMT; Package Quantity: 5000; Case/Package: 0603; Radiation Hardening: No; Number of Pins: 2; Length: 1.6mm; Lead Free: LeadFree; Voltage Rating (DC): 50V; Military Standard: Not; Datasheet URL: http://www.yageo.com/NewPortal/yageodocoutput?fileName=/pdf/R-Chip/PYu-RC_Group_51_RoHS_L_5.pdf; Manufacturer URL: http://www.yageo.com/; Packaging: TapeandReel; Case Code (Metric): 1608; Min Operating Temperature: -55degC; Composition: ThickFilm; RoHSCompliant: true; Contact Plating: Tin; Datasheet Version: Rev. 5, 10/2016; REACH SVHC: NoSVHC
R100-R102 = CMP-2000-03637-1: Manufacturer: Vishay Dale; Tolerance: 1%; Power Rating: 100mW; Temperature Coefficient: 100ppm/°C; Voltage Rating: 75V; Part Number: CRCW060390R9FKEA; Supplier 1: Mouser; Supplier Part Number 1: 71-CRCW0603-90.9-E3; Manufacturer Part Number: CRCW060390R9FKEA; RoHS: Yes; Category: Chip SMD Resistors; Stock 1: 1004; Pricing 1: 1=0,11000, 10=0,04200, 50=0,04200, 100=0,01700, 1000=0,00900, 10000=0,00500 (USD); Case/Package: 0603; Case Code (Metric): 1608; Contact Plating: Tin; Weight: 7.1E-05oz; Min Operating Temperature: -55°C; Max Operating Temperature: 155°C; Packaging: Tape and Reel; Resistor Type: Thick Film; Number of Terminations: 2; Series: CRCW; Max Power Dissipation: 100mW; Resistance Tolerance: 1%; Package Quantity: 10; Termination: SMD/SMT; Technology: THICK FILM; Features: Automotive AEC-Q200; Construction: Rectangular; Working Voltage: 75V; Length: 1.55mm; Width: 0.85mm; Height: 0.45mm; Depth: 0.85mm; Radiation Hardening: No; RoHS Compliant: Yes; REACH SVHC: Unknown; Military Standard: Not; ComponentLink1URL: https://datasheet.ciiva.com/2494/dcrcwe3-2494729.pdf?src-supplier=Digi-Key; ComponentLink1Description: https://datasheet.ciiva.com/2494/dcrcwe3-2494729.pdf?src-supplier=Digi-Key; ComponentLink2URL: https://datasheet.ciiva.com/2494/dcrcwe3-2494730.pdf?src-supplier=Digi-Key; ComponentLink2Description: https://datasheet.ciiva.com/2494/dcrcwe3-2494730.pdf?src-supplier=Digi-Key; ComponentLink3URL: https://datasheet.ciiva.com/16758/70201119-16758186.pdf?src-supplier=Allied+Electronics; ComponentLink3Description: https://datasheet.ciiva.com/16758/70201119-16758186.pdf?src-supplier=Allied+Electronics; ComponentLink4URL: https://datasheet.ciiva.com/2494/dcrcwe3-2494731.pdf?src-supplier=Digi-Key; ComponentLink4Description: https://datasheet.ciiva.com/2494/dcrcwe3-2494731.pdf?src-supplier=Digi-Key; ComponentLink5URL: https://datasheet.ciiva.com/22705/1697337-22705563.pdf?src-supplier=Element14; ComponentLink5Description: https://datasheet.ciiva.com/22705/1697337-22705563.pdf?src-supplier=Element14; ComponentLink6URL: https://datasheet.ciiva.com/22683/1912744-22683196.pdf?src-supplier=Element14; ComponentLink6Description: https://datasheet.ciiva.com/22683/1912744-22683196.pdf?src-supplier=Element14; ComponentLink7URL: https://datasheet.ciiva.com/16199/dcrcwe3-16199774.pdf?src-supplier=Future+Electronics; ComponentLink7Description: https://datasheet.ciiva.com/16199/dcrcwe3-16199774.pdf?src-supplier=Future+Electronics; ComponentLink8URL: https://datasheet.ciiva.com/3257/dcrcwe3-3257967.pdf?src-supplier=Avnet; ComponentLink8Description: https://datasheet.ciiva.com/3257/dcrcwe3-3257967.pdf?src-supplier=Avnet
R119 R120 = CMP-2000-06942-1: Chip Resistor, 4.7 KOhm, +/- 1%, 0.1 W, -55 to 155 degC, 0603 (1608 Metric), RoHS, Tape and Reel; Manufacturer: Yageo; Power Rating: 100mW; Temperature Coefficient: 100PPM/C; Voltage Rating: 50V; Package Reference: 0603; Series: RC; Datasheet Version: Rev. 7, 05/2017; Packaging: Reel; Termination Style: SMD/SMT; Datasheet URL: http://www.yageo.com/documents/recent/PYu-RC_Group_51_RoHS_L_7.pdf; Manufacturer URL: http://www.yageo.com/; Package Description: 2-Pin Surface Mount Device, Body 1.6 x 0.8 mm; Case Code - mm: 1608; Mounting Technology: SurfaceMount; Operating Temperature Range: -55Cto+155C; Tolerance: 1%; Product: ThickFilmResistorsGeneralPurpose; Supplier 1: Mouser; Supplier Part Number 1: 603-RC0603FR-074K7L; Manufacturer Part Number: RC0603FR-074K7L; RoHS: Yes; Category: Chip SMD Resistors; Stock 1: 772810; Pricing 1: 1=0,10000, 10=0,02400, 50=0,02400, 100=0,01000, 1000=0,00400, 5000=0,00300, 10000=0,00300 (USD); Case/Package: 0603; Number of Pins: 2; Case Code (Imperial): 0603; Case Code (Metric): 1608; Size Code: 0603; Min Operating Temperature: -55°C; Max Operating Temperature: 155°C; Voltage Rating (DC): 50V; Termination: SMD/SMT; Resistor Type: Thick Film; Features: Moisture Resistant; Max Power Dissipation: 100mW; Number of Terminations: 2; Construction: Rectangular; Resistance Tolerance: 1%; Length: 1.6mm; Width: 0.8mm; Height: 0.45mm; Depth: 0.8mm; Lead Pitch: 0.3mm; REACH SVHC: No SVHC; Military Standard: Not; Lead Free: Lead Free; RoHS Compliant: Yes; ComponentLink1URL: https://datasheet.ciiva.com/15189/getdatasheetpartid-422754-15189760.pdf?src-supplier=Verical; ComponentLink1Description: https://datasheet.ciiva.com/15189/getdatasheetpartid-422754-15189760.pdf?src-supplier=Verical; ComponentLink2URL: https://datasheet.ciiva.com/22747/443971-22747528.pdf?src-supplier=Element14; ComponentLink2Description: https://datasheet.ciiva.com/22747/443971-22747528.pdf?src-supplier=Element14; ComponentLink3URL: https://datasheet.ciiva.com/7660/38590-7660794.pdf?src-supplier=Element14; ComponentLink3Description: https://datasheet.ciiva.com/7660/38590-7660794.pdf?src-supplier=Element14; ComponentLink4URL: https://datasheet.ciiva.com/7746/1868787-7746365.pdf?src-supplier=Element14; ComponentLink4Description: https://datasheet.ciiva.com/7746/1868787-7746365.pdf?src-supplier=Element14; ComponentLink5URL: https://datasheet.ciiva.com/46440/1868787-46440909.pdf?src-supplier=Element14; ComponentLink5Description: https://datasheet.ciiva.com/46440/1868787-46440909.pdf?src-supplier=Element14; ComponentLink6URL: https://datasheet.ciiva.com/7746/1738695-7746366.pdf?src-supplier=Element14; ComponentLink6Description: https://datasheet.ciiva.com/7746/1738695-7746366.pdf?src-supplier=Element14
R144 = CMP-2000-00875-1: Manufacturer: Panasonic; Manufacturer Part Number: ERA-3AEB104V; Power Rating: 100mW; Tolerance: 0.1%; Voltage Rating: 75V; Temperature Coefficient: 25ppm/°C; Part Number: ERA3AEB104V; Supplier 1: Mouser; Supplier Part Number 1: 667-ERA-3AEB104V; RoHS: Yes; Category: Chip SMD Resistors; Stock 1: 3419; Pricing 1: 1=0,35000, 10=0,30000, 50=0,30000, 100=0,11700, 1000=0,04900, 2500=0,04500, 5000=0,04400, 10000=0,04400 (USD); Mount: Surface Mount; Case/Package: 0603; Number of Pins: 2; Case Code (Metric): 1608; Contact Plating: Tin; Min Operating Temperature: -55°C; Max Operating Temperature: 155°C; Packaging: Tape and Reel; Termination: SMD/SMT; Max Power Dissipation: 100mW; Series: ERA; Package Quantity: 5000; Resistor Type: Thin Film; Number of Terminations: 2; Construction: Rectangular; Resistance Tolerance: 0.1%; Features: Automotive AEC-Q200; Technology: THIN FILM; Working Voltage: 75V; Length: 1.6mm; Width: 0.8mm; Height: 0.45mm; Depth: 0.8mm; Radiation Hardening: No; REACH SVHC: No SVHC; Military Standard: Not; RoHS Compliant: Yes; ComponentLink1URL: https://datasheet.ciiva.com/11808/0900766b80fe20f7-11808030.pdf?src-supplier=RSComponents; ComponentLink1Description: https://datasheet.ciiva.com/11808/0900766b80fe20f7-11808030.pdf?src-supplier=RSComponents; ComponentLink2URL: https://datasheet.ciiva.com/29183/451655-da-01-en-widerstand-0603-era-29183868.pdf?src-supplier=Conrad; ComponentLink2Description: https://datasheet.ciiva.com/29183/451655-da-01-en-widerstand-0603-era-29183868.pdf?src-supplier=Conrad; ComponentLink3URL: https://datasheet.ciiva.com/46388/485442-46388111.pdf?src-supplier=Element14; ComponentLink3Description: https://datasheet.ciiva.com/46388/485442-46388111.pdf?src-supplier=Element14; ComponentLink4URL: https://datasheet.ciiva.com/5734/485442-5734533.pdf?src-supplier=Farnell; ComponentLink4Description: https://datasheet.ciiva.com/5734/485442-5734533.pdf?src-supplier=Farnell; ComponentLink5URL: https://datasheet.ciiva.com/46422/485442-46422521.pdf?src-supplier=Element14; ComponentLink5Description: https://datasheet.ciiva.com/46422/485442-46422521.pdf?src-supplier=Element14; ComponentLink6URL: https://datasheet.ciiva.com/48530/era-eng-tds-48530350.pdf?src-supplier=Distrelec; ComponentLink6Description: https://datasheet.ciiva.com/48530/era-eng-tds-48530350.pdf?src-supplier=Distrelec; ComponentLink7URL: https://datasheet.ciiva.com/16724/70068849-16724943.pdf?src-supplier=Allied+Electronics; ComponentLink7Description: https://datasheet.ciiva.com/16724/70068849-16724943.pdf?src-supplier=Allied+Electronics; ComponentLink8URL: https://datasheet.ciiva.com/9186/aoa0000ce26-9186700.pdf?src-supplier=Avnet; ComponentLink8Description: https://datasheet.ciiva.com/9186/aoa0000ce26-9186700.pdf?src-supplier=Avnet; ComponentLink9URL: https://datasheet.ciiva.com/16202/aoa0000ce26-16202041.pdf?src-supplier=Future+Electronics; ComponentLink9Description: https://datasheet.ciiva.com/16202/aoa0000ce26-16202041.pdf?src-supplier=Future+Electronics; ComponentLink10URL: https://datasheet.ciiva.com/30100/54aoa0000ce26-30100782.pdf?src-supplier=Onlinecomponents.com; ComponentLink10Description: https://datasheet.ciiva.com/30100/54aoa0000ce26-30100782.pdf?src-supplier=Onlinecomponents.com
SW1 = CMP-2000-05160-2: SWITCH TACTILE SPST-NO 0.05A 12V; Contact Resistance: 100mR; Throw Configuration: SPST; Illumination Type: Non-Illuminated; Mechanical Life: 100000Cycles; Current Rating: 50mA; Switch Function: Off-Mom; Actuator Length: 0.85mm; Actuator Material: Nylon; Actuator Type: Standard; Operating Force: 160gf; Min Operating Temperature: -20°C; REACH SVHC: No SVHC; Termination: Gull Wing; Case/Package: SMD/SMT; Packaging: Tape and Reel; Mount: Surface Mount; Voltage Rating (DC): 12V; Orientation: Straight; Lead Free: Lead Free; Contact Material: Silver; Color: Black; Max Current Rating: 50mA; Contact Plating: Silver; Depth: 9mm; Package Quantity: 1; Max Voltage Rating (DC): 12V; Length: 6mm; Max Operating Temperature: 60°C
U4 = CMP-1570-00007-1: ARM-Based Cortex-M7 32 Bit MCU+FPU, 462 DMIPS, 1024 kB Flash, 320 kB RAM, 114 I/Os, -40 to 85 degC, 144-Pin LQFP, Halogen-Free, Tray; Manufacturer: STMicroelectronics; Program Memory Size: 1024 KByte; Data RAM Size: 320 KByte; Supply Voltage Max: 3.6 V; Number of I/Os: 114; Supply Voltage Min: 1.7 V; Clock Frequency Max: 216 MHz; L1 Cache Instruction Memory: 4 KByte; Frequency: 216MHz; Interface: I2C,SPI,USB,CAN,Ethernet,IrDA,SD,UART,USART,LIN,EBI/EMI; Oscillator Type: Internal; RAM Size: 320KB; Min Supply Voltage: 1.7V; Max Supply Voltage: 3.6V; Data Bus Width: 32b; Number of USB Channels: 2; Number of ADC Channels: 24; Number of Timers/Counters: 15; Number of PWM Channels: 6; Data Rate: 480Mbps; Memory Type: FLASH,OTP; Memory Size: 1MB; Peripherals: Brown-out Detect/Reset,POR,PWM,WDT,DMA,LCD; Core Architecture: ARM; PackageDescription: 144-Pin Low Profile Quad Flat Package, 20 x 20 mm Body, 0.5 mm Pitch; ComponentLink1Description: Manufacturer URL; Mounting Technology: Surface Mount; PartNumber: STM32F746ZG; ComponentLink1URL: http://www.st.com/web/en/home.html; Temperature Min: -40 degC; Packing: Tray; ComponentLink2Description: Datasheet; Temperature Max: 85 degC; ComponentLink3URL: http://www.st.com/st-web-ui/static/active/en/resource/technical/document/datasheet/DM00037051.pdf; ComponentLink3Description: Package Specification; L1 Cache Data Memory: 4 KByte; DatasheetVersion: Rev. 1; ComponentLink2URL: http://www.st.com/st-web-ui/static/active/en/resource/technical/document/datasheet/DM00166116.pdf; Supplier 1: Mouser; Supplier Part Number 1: 511-STM32F746ZGT6; Manufacturer Part Number: STM32F746ZGT6; RoHS: Yes; Category: Microcontrollers; Stock 1: 15; Pricing 1: 1=17,14000, 10=15,76000, 25=15,10000, 50=15,10000, 100=13,31000, 250=12,66000, 500=11,83000, 1000=10,88000, 2500=10,46000, 10000=11,83000 (USD); Mount: Surface Mount; Case/Package: LQFP; Number of Pins: 144; Min Operating Temperature: -40°C; Max Operating Temperature: 85°C; Packaging: Tray; Max Frequency: 216MHz; Length: 20.2mm; Width: 20.2mm; Height: 1.45mm; REACH SVHC: No SVHC; Lead Free: Lead Free; RoHS Compliant: Yes; ComponentLink4URL: http://www.alliedelec.com/images/products/datasheets/bm/STMICROELECTRONICS/70612621.pdf?src-supplier=Allied+Electronics; ComponentLink4Description: http://www.alliedelec.com/images/products/datasheets/bm/STMICROELECTRONICS/70612621.pdf?src-supplier=Allied+Electronics; ComponentLink5URL: http://www.mouser.com/ds/2/389/stm32f745ie-956321.pdf?src-supplier=Mouser; ComponentLink5Description: http://www.mouser.com/ds/2/389/stm32f745ie-956321.pdf?src-supplier=Mouser; ComponentLink6URL: http://www.st.com/content/ccc/resource/technical/document/errata_sheet/4d/39/a6/8c/84/47/47/67/DM00145382.pdf/files/DM00145382.pdf/jcr:content/translations/en.DM00145382.pdf?src-supplier=Digi-Key; ComponentLink6Description: http://www.st.com/content/ccc/resource/technical/document/errata_sheet/4d/39/a6/8c/84/47/47/67/DM00145382.pdf/files/DM00145382.pdf/jcr:content/translations/en.DM00145382.pdf?src-supplier=Digi-Key; ComponentLink7URL: https://4donline.ihs.com/images/VipMasterIC/IC/SGST/SGST-S-A0001541368/SGST-S-A0001541368-1.pdf?hkey=52A5661711E402568146F3353EA87419&src-supplier=Farnell; ComponentLink7Description: https://4donline.ihs.com/images/VipMasterIC/IC/SGST/SGST-S-A0001541368/SGST-S-A0001541368-1.pdf?hkey=52A5661711E402568146F3353EA87419&src-supplier=Farnell; ComponentLink8URL: https://4donline.ihs.com/images/VipMasterIC/IC/SGST/SGST-S-A0001541368/SGST-S-A0001541368-1.pdf?hkey=52A5661711E402568146F3353EA87419&src-supplier=Newark; ComponentLink8Description: https://4donline.ihs.com/images/VipMasterIC/IC/SGST/SGST-S-A0001541368/SGST-S-A0001541368-1.pdf?hkey=52A5661711E402568146F3353EA87419&src-supplier=Newark; ComponentLink9URL: http://www.farnell.com/datasheets/2006547.pdf?src-supplier=Element14; ComponentLink9Description: http://www.farnell.com/datasheets/2006547.pdf?src-supplier=Element14
X1 = CMP-1688-00003-1: Ceramic SMD Crystal, 16 MHz, +/- 20 ppm, 50 Ohm, -20 to 70 degC, 4-Pin SMD, RoHS, Tape and Reel; Current Rating: 1.82 A; Resistance: 0.033 Ohm; Tolerance: 30%; Shielding: Shielded; REACH SVHC: Unknown; RoHSCompliant: True; PackageReference: ABM3B; Mount: Surface Mount; Max Operating Temperature: 105degC; DatasheetVersion: Aug-15; Package Quantity: 500; PackageDescription: 4-Pin Surface Mount Device, Body 5 x 3.2 mm; ComponentLink2URL: http://www.abracon.com/Resonators/abm3b.pdf; Packaging: Tape and Reel; Height: 2.8 mm; ComponentLink1URL: http://www.abracon.com/; ComponentLink2Description: Datasheet; Length: 0.197 inch; ComponentLink1Description: Manufacturer URL; Case/Package: 5028; Width: 0.197 inch; Min Operating Temperature: -40degC